# EAGLE design ESP8266_MQTT_light (EAGLE 9.4.2)
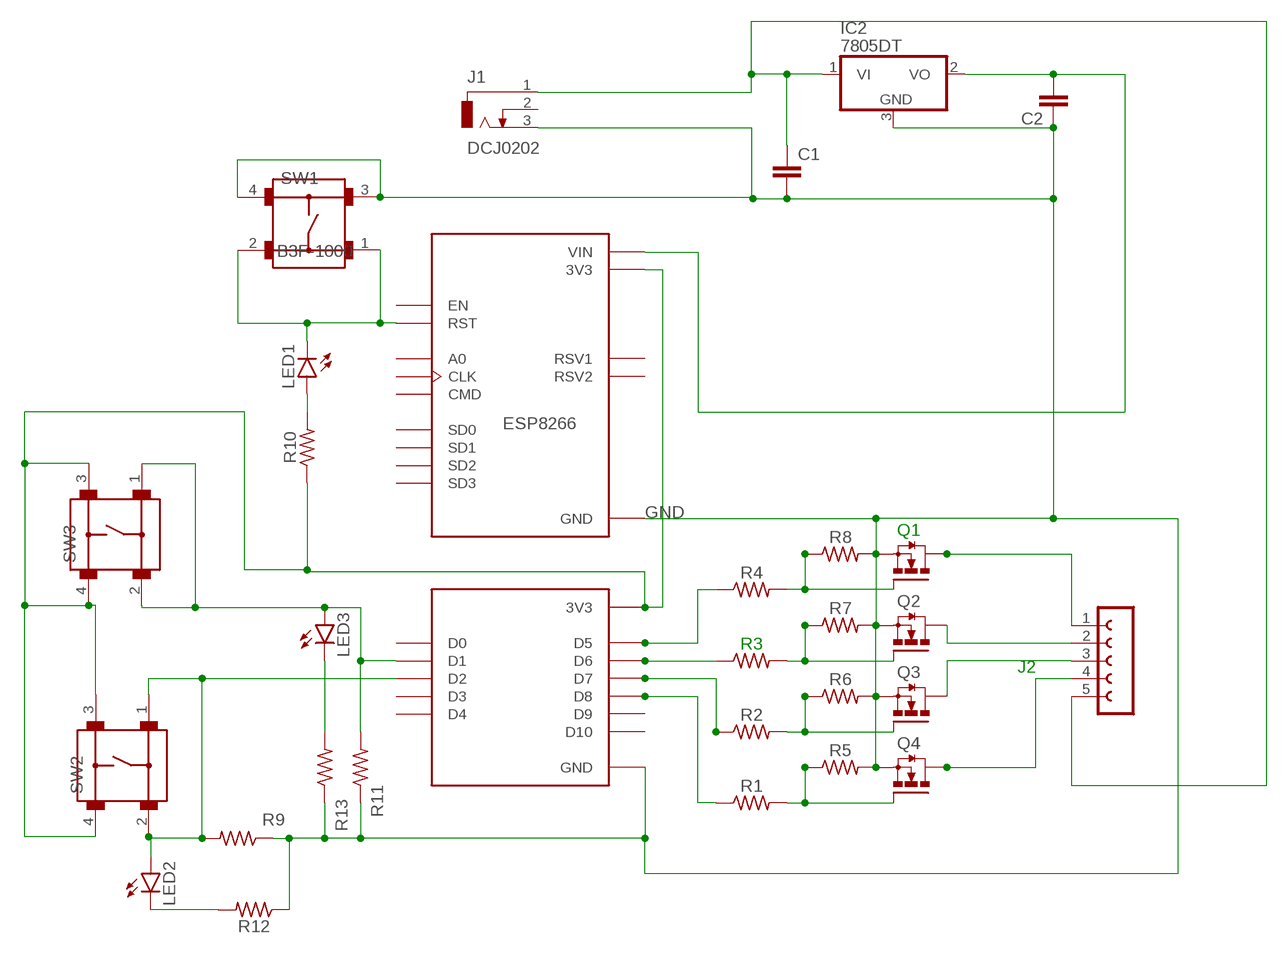
[diagram p0: schematic, sheet 1]

## Parts
C1  CC1005  [C1005]
C2  CC1005  [C1005]
ESP8266  113990105  [SEEED_113990105]
IC2  7805DT  [TO252]
J1  DCJ0202  [DCJ0202]
J2  RGBW1  FE05W  [FE05W]
LED1  LEDCHIPLED_1206  [CHIPLED_1206]
LED2  LEDCHIPLED_1206  [CHIPLED_1206]
LED3  LEDCHIPLED_1206  [CHIPLED_1206]
Q1  IRF3704S  [D2PACK]
Q2  IRF3704S  [D2PACK]
Q3  IRF3704S  [D2PACK]
Q4  IRF3704S  [D2PACK]
R1  1k  R-US_R1206  [R1206]
R2  1k  R-US_R1206  [R1206]
R3  1k  R-US_R1206  [R1206]
R4  1k  R-US_R1206  [R1206]
R5  10k  R-US_R1206  [R1206]
R6  10k  R-US_R1206  [R1206]
R7  10k  R-US_R1206  [R1206]
R8  10k  R-US_R1206  [R1206]
R9  10k  R-US_R1206  [R1206]
R10  33  R-US_R1206  [R1206]
R11  10k  R-US_R1206  [R1206]
R12  33  R-US_R1206  [R1206]
R13  33  R-US_R1206  [R1206]
SW1  B3F-1000  [B3F-1000]
SW2  B3F-1000  [B3F-1000]
SW3  B3F-1000  [B3F-1000]

## Nets
3.3VDC: ESP8266.J1_11(3V3) ESP8266.J2_6(3V3) ESP8266.J2_15(3V3) R10.1 SW2.3 SW2.4 SW3.3 SW3.4
5VDC: C2.2 ESP8266.J1_15(VIN) IC2.2(VO)
12VDC: C1.1 IC2.1(VI) J1.1 J2.5
B-IN: Q2.1(G) R3.2 R7.1
B-MAIN: ESP8266.J2_9(D6) R3.1
B-OUT: J2.2 Q2.2(D)
G-IN: Q3.1(G) R2.2 R6.1
G-MAIN: ESP8266.J2_10(D7) R2.1
G-OUT: J2.3 Q3.2(D)
GND: C1.2 C2.1 ESP8266.J1_10(GND) ESP8266.J1_14(GND) ESP8266.J2_7(GND) ESP8266.J2_14(GND) IC2.3(GND) J1.3 Q1.3(S) Q2.3(S) Q3.3(S) Q4.3(S) R5.2 R6.2 R7.2 R8.2 R9.1 R11.1 R12.1 R13.1 SW1.3 SW1.4
N$1: LED1.A R10.2
N$2: LED2.C R12.2
N$3: LED3.C R13.2
N$5: ESP8266.J2_3(D2) LED2.A R9.2 SW2.1 SW2.2
R-IN: Q4.1(G) R1.2 R5.1
R-MAIN: ESP8266.J2_11(D8) R1.1
R-OUT: J2.4 Q4.2(D)
RESET: ESP8266.J1_13(RST) LED1.C SW1.1 SW1.2
W-CTL: ESP8266.J2_2(D1) LED3.A R11.2 SW3.1 SW3.2
W-IN: Q1.1(G) R4.2 R8.1
W-MAIN: ESP8266.J2_8(D5) R4.1
W-OUT: J2.1 Q1.2(D)
Unconnected: ESP8266.J1_1(A0) ESP8266.J1_2(RSV1) ESP8266.J1_3(RSV2) ESP8266.J1_4(SD3) ESP8266.J1_5(SD2) ESP8266.J1_6(SD1) ESP8266.J1_7(CMD) ESP8266.J1_8(SD0) ESP8266.J1_9(CLK) ESP8266.J1_12(EN) ESP8266.J2_1(D0) ESP8266.J2_4(D3) ESP8266.J2_5(D4) ESP8266.J2_12(D9) ESP8266.J2_13(D10) J1.2

## Library data of the parts
C1 C2 = eagle-ltspice:C: CAPACITOR, European symbol; SPICEMODEL: NONE; SPICEPREFIX: C
ESP8266 = 113990105:113990105: NodeMCU v2 - Lua based ESP8266 development kit; AVAILABILITY: Unavailable; DESCRIPTION: An open-source firmware and development kit that helps you to Prototype your IOT product within a few Lua script lines; MF: Seeed Technology; MP: NodeMCU v2; PACKAGE: None; PRICE: None
IC2 = linear:78*: Positive VOLTAGE REGULATOR Source: http://cache.national.com/ds/LM/LM78L05.pdf http://www.fairchildsemi.com/ds/LM/LM7805.pdf
J1 = con-jack:DCJ0202: DC POWER JACK Source: DCJ0202.pdf; OC_FARNELL: unknown; OC_NEWARK: unknown
J2 = con-lsta:FE05W: FEMALE HEADER; OC_FARNELL: unknown; OC_NEWARK: unknown
LED1-LED3 = led:LED: LED OSRAM: - CHIPLED LG R971, LG N971, LY N971, LG Q971, LY Q971, LO R971, LY R971 LH N974, LH R974 LS Q976, LO Q976, LY Q976 LO Q996 - Hyper CHIPLED LW Q18S LB Q993, LB Q99A, LB R99A - SideLED LS A670, LO A670, LY A670, LG A670, LP A670 LB A673, LV A673, LT A673, LW A673 LH A674 LY A675 LS A676, LA A676, LO A676, LY A676, LW A676 LS A679, LY A679, LG A679 - Hyper Micro SIDELED® LS Y876, LA Y876, LO Y876, LY Y876 LT Y87S - SmartLED LW L88C, LW L88S LB L89C, LB L89S, LG L890 LS L89K, LO L89K, LY L89K LS L896, LA L896, LO L896, LY L896 - TOPLED LS T670, LO T670, LY T670, LG T670, LP T670 LSG T670, LSP T670, LSY T670, LOP T670, LYG T670 LG T671, LOG T671, LSG T671 LB T673, LV T673, LT T673, LW T673 LH T674 LS T676, LA T676, LO T676, LY T676, LB T676, LH T676, LSB T676, LW T676 LB T67C, LV T67C, LT T67C, LS T67K, LO T67K, LY T67K, LW E67C LS E67B, LA E67B, LO E67B, LY E67B, LB E67C, LV E67C, LT E67C LW T67C LS T679, LY T679, LG T679 LS T770, LO T770, LY T770, LG T770, LP T770 LB T773, LV T773, LT T773, LW T773 LH T774 LS E675, LA E675, LY E675, LS T675 LS T776, LA T776, LO T776, LY T776, LB T776 LHGB T686 LT T68C, LB T68C - Hyper Mini TOPLED® LB M676 - Mini TOPLED Santana® LG M470 LS M47K, LO M47K, LY M47K Source: http://www.osram.convergy.de LUXEON: - LUMILED® LXK2-PW12-R00, LXK2-PW12-S00, LXK2-PW14-U00, LXK2-PW14-V00 LXK2-PM12-R00, LXK2-PM12-S00, LXK2-PM14-U00 LXK2-PE12-Q00, LXK2-PE12-R00, LXK2-PE12-S00, LXK2-PE14-T00, LXK2-PE14-U00 LXK2-PB12-K00, LXK2-PB12-L00, LXK2-PB12-M00, LXK2-PB14-N00, LXK2-PB14-P00, LXK2-PB14-Q00 LXK2-PR12-L00, LXK2-PR12-M00, LXK2-PR14-Q00, LXK2-PR14-R00 LXK2-PD12-Q00, LXK2-PD12-R00, LXK2-PD12-S00 LXK2-PH12-R00, LXK2-PH12-S00 LXK2-PL12-P00, LXK2-PL12-Q00, LXK2-PL12-R00 Source: www.luxeon.com KINGBRIGHT: KA-3528ASYC Source: www.kingbright.com
Q1-Q4 = transistor-power:IRF3704: SMPS MOSFET HEXFET® Power MOSFET Source: http://www.irf.com/product-info/datasheets/data/irf3704.pdf
R1-R13 = rcl:R-US_: RESISTOR, American symbol; SPICEPREFIX: R
SW1-SW3 = Switch:B3F-1000: Tactile Switch SPST-NO Top Actuated Through Hole Manufacturer's datasheet <https://omronfs.omron.com/en_US/ecb/products/pdf/en-b3f.pdf>; CREATED_BY: PCBLayout.com; DIGI_KEY_PART_NUMBER: SW400-ND; MANUFACTURER: Omron Electronics Inc-EMC Div; MPN: B3F-1000; PACKAGE: SPST-NO

## Board
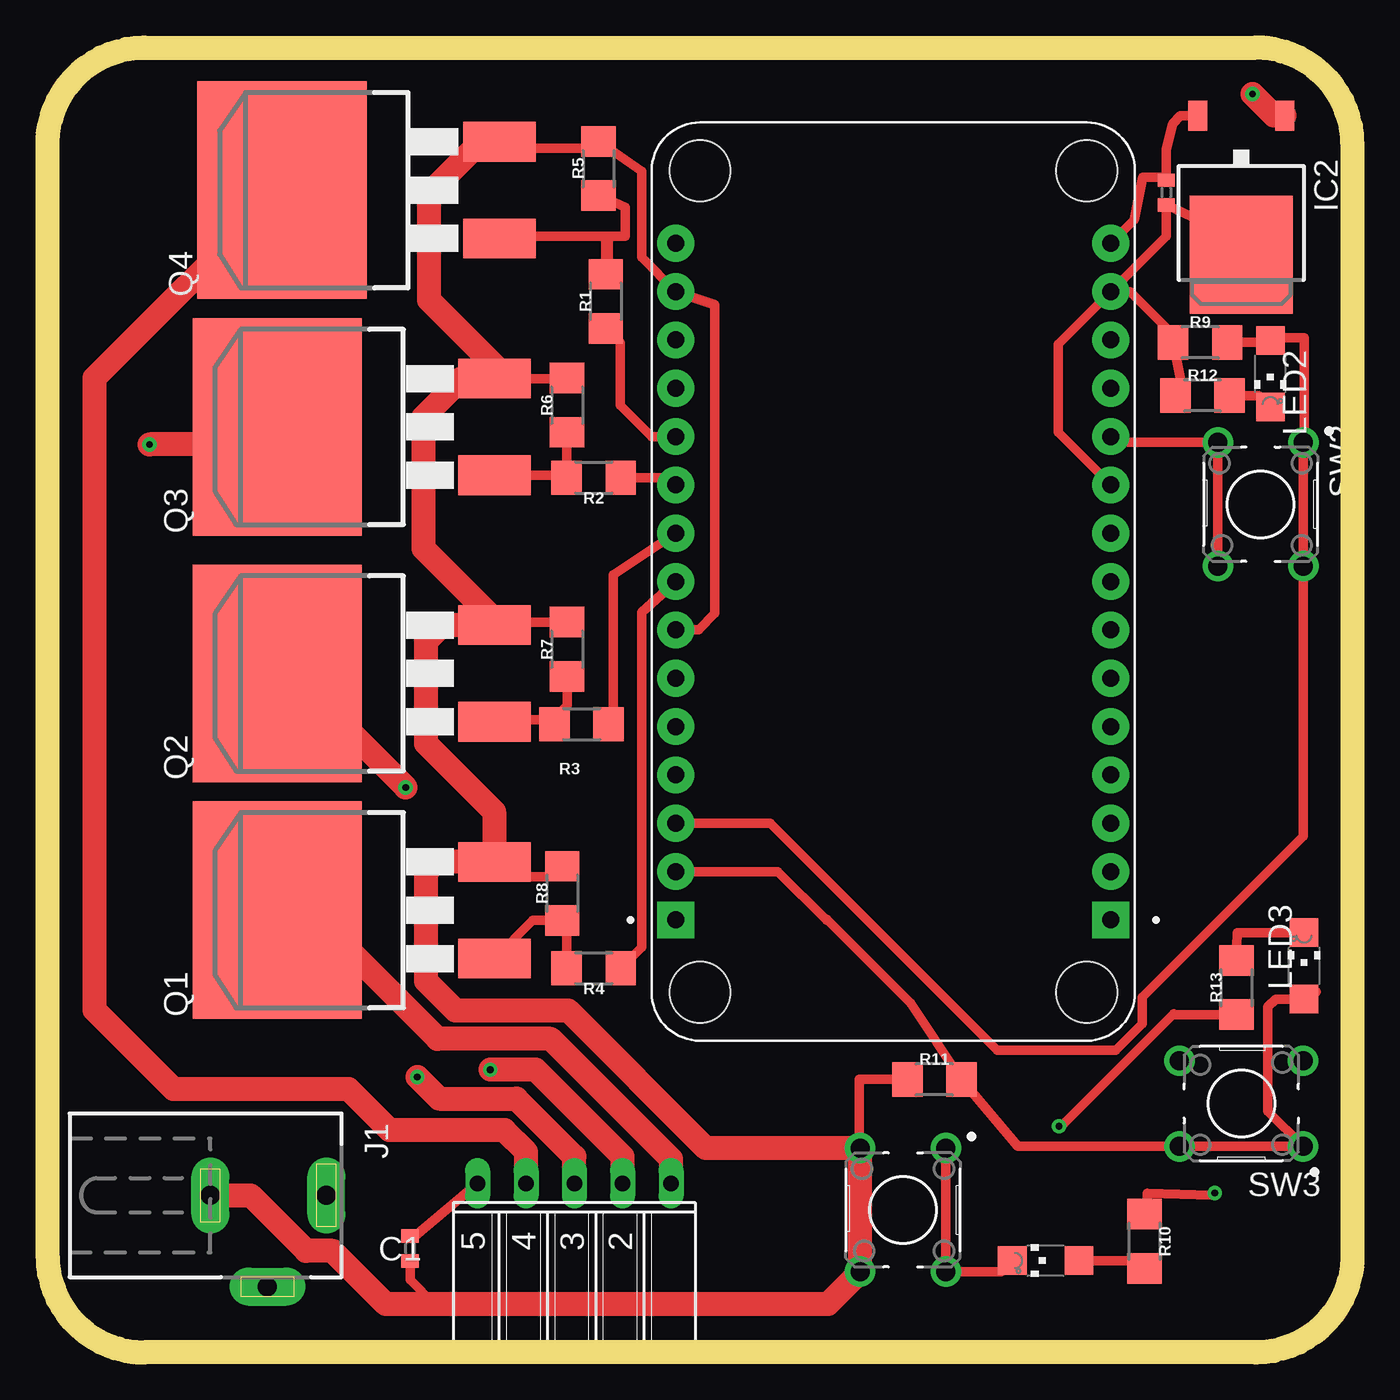
[diagram p1: board, top side]
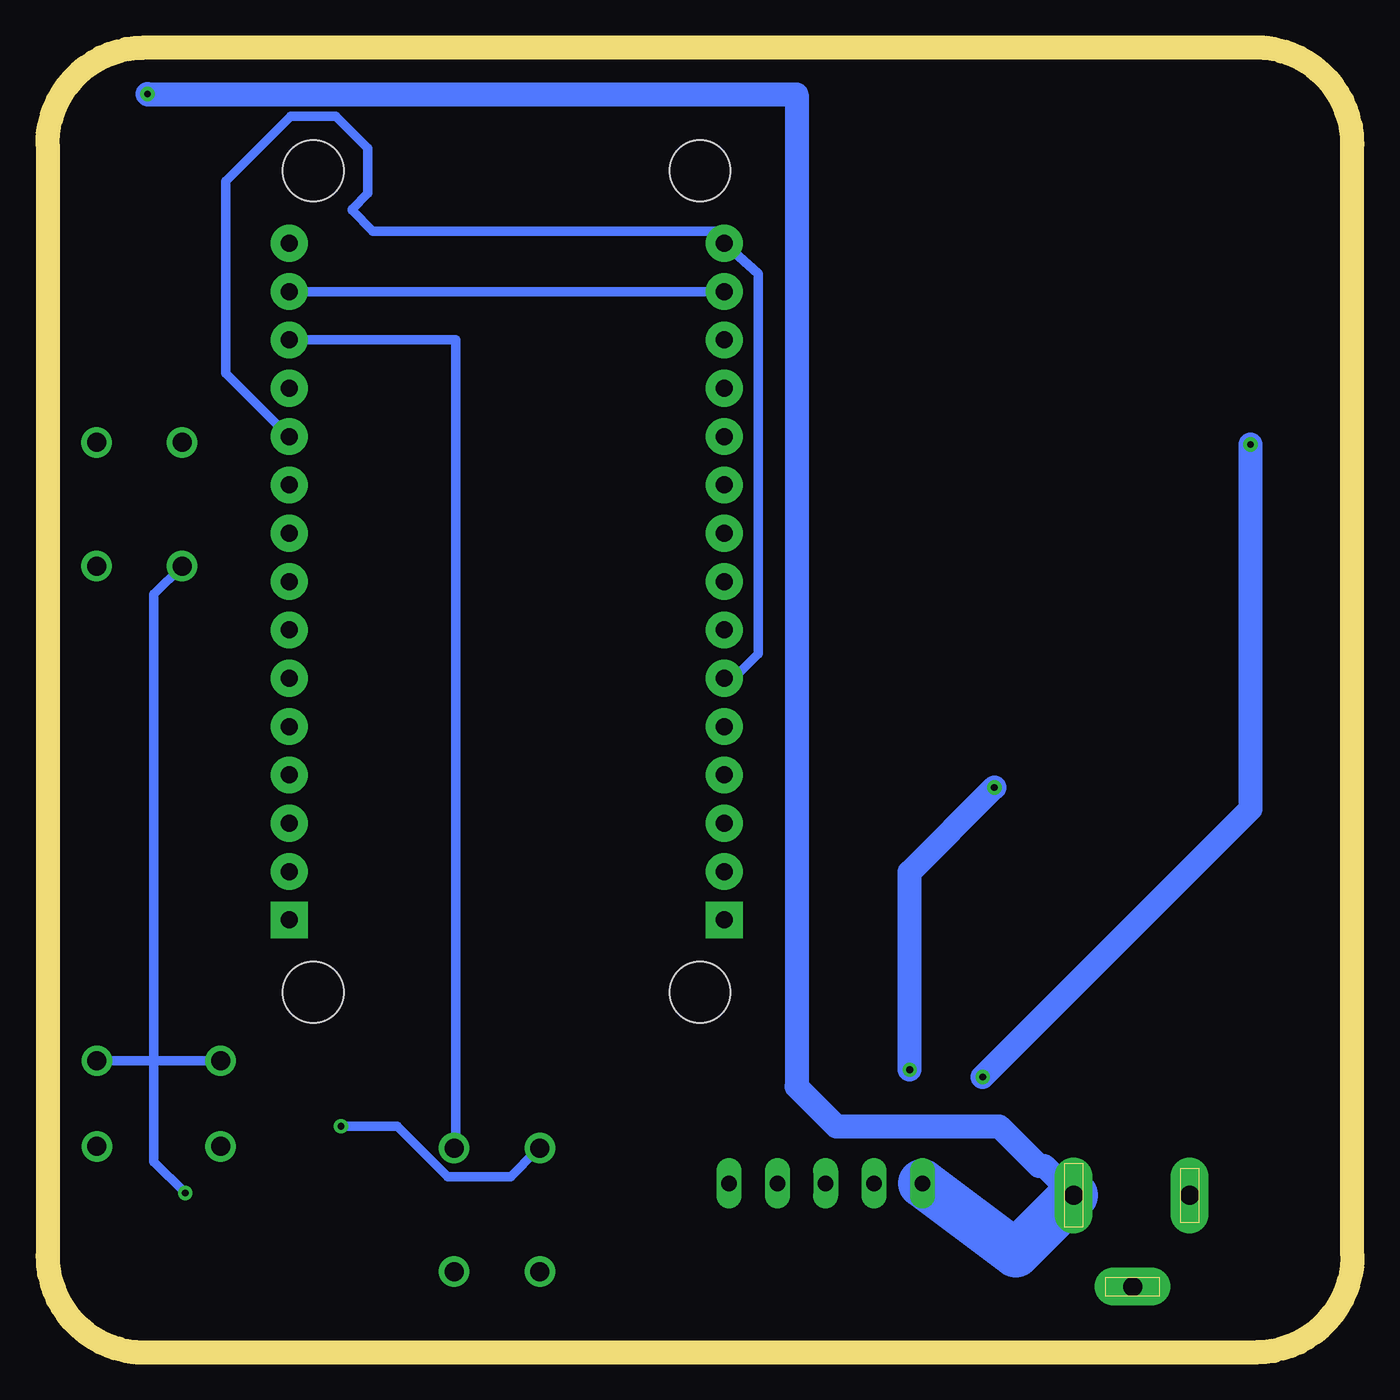
[diagram p2: board, bottom side, seen from below]

Size 68.58 x 68.58 mm. Coordinates in mm from the lower left corner, seen from the top.
Outline: 68.58,5.08 68.58,63.5 arc90 63.5,68.58 5.08,68.58 arc90 0,63.5 0,5.08 arc90 5.08,0 63.5,0
Outline: 68.58,5.08 arc-90 63.5,0
Outline: 68.58,5.08 arc-90 63.5,0
Copper layers (1*16): Top 0.035mm / dielectric 1.5mm / Bottom 0.035mm
Design rules "default *": minimum track width 20mil, minimum drill 0.35mm, track to track 6mil, track to pad 6mil, pad to pad 6mil, via to via 6mil, smd to smd 6mil, copper to edge 40mil, drill to drill 6mil, minimum pad ring 10mil, minimum via ring 8mil, stop-mask expansion 4mil, vias tented up to drill 0mil, thermal gap 10mil

### Footprints (pad centres in the part's own frame; a part is rotated, then mirrored left to right if it is on the bottom)
C1005 = smd 0.7 x 0.9: 1 -0.65,0; 2 0.65,0
SEEED_113990105 = drill 0.889 pad 1.93 square: J1_1 -11.43,17.78; J2_1 11.43,17.78 | drill 0.889 pad 1.93: J1_2 -11.43,15.24; J1_3 -11.43,12.7; J1_4 -11.43,10.16; J1_5 -11.43,7.62; J1_6 -11.43,5.08; J1_7 -11.43,2.54; J1_8 -11.43,0; J1_9 -11.43,-2.54; J1_10 -11.43,-5.08; J1_11 -11.43,-7.62; J1_12 -11.43,-10.16; J1_13 -11.43,-12.7; J1_14 -11.43,-15.24; J1_15 -11.43,-17.78; J2_2 11.43,15.24; J2_3 11.43,12.7; J2_4 11.43,10.16; J2_5 11.43,7.62; J2_6 11.43,5.08; J2_7 11.43,2.54; J2_8 11.43,0; J2_9 11.43,-2.54; J2_10 11.43,-5.08; J2_11 11.43,-7.62; J2_12 11.43,-10.16; J2_13 11.43,-12.7; J2_14 11.43,-15.24; J2_15 11.43,-17.78 | hole 3.2: -10.16,21.59; 10.16,21.59; 10.16,-21.59; -10.16,-21.59
TO252 = smd 1 x 1.6: 1 -2.28,-4.8; 2 2.28,-4.8 | smd 5.4 x 6.2: 3 0,2.5
DCJ0202 = drill 1 pad 2 long: 1 0,3.1; 2 4.8,0; 3 0,-3
FE05W = drill 0.813 long: 1 -5.08,0; 2 -2.54,0; 3 0,0; 4 2.54,0; 5 5.08,0
CHIPLED_1206 = smd 1.5 x 1.5: A 0,-1.75; C 0,1.75
D2PACK = smd 2.083 x 3.81: 1 -2.54,-8.89; 3 2.54,-8.89 | smd 11.43 x 8.89: 2 0,2.54
R1206 = smd 1.6 x 1.803: 1 -1.422,0; 2 1.422,0
B3F-1000 = drill 1 pad 1.6: 1 -3.25,2.25; 2 3.25,2.25; 3 -3.25,-2.25; 4 3.25,-2.25

### Placement (x,y rotation side)
C1  19.05,5.46 270 top
C2  58.8,60.96 90 top
ESP8266  44.45,40.51 180 top
IC2  62.74,60.2 180 top
J1  11.56,8.26 270 top
J2  27.69,8.89 180 top
LED1  52.45,4.83 90 top
LED2  64.26,51.44 180 top
LED3  66.04,20.32 0 top
Q1  14.61,23.24 90 top
Q2  14.61,35.69 90 top
Q3  14.61,48.64 90 top
Q4  14.86,61.09 90 top
R1  29.34,55.24 90 top
R2  28.7,45.97 180 top
R3  28.07,33.02 180 top
R4  28.7,20.19 180 top
R5  28.96,62.23 90 top
R6  27.3,49.78 90 top
R7  27.3,36.96 90 top
R8  27.05,24.13 90 top
R9  60.58,53.09 0 top
R10  57.66,5.84 270 top
R11  46.61,14.35 0 top
R12  60.71,50.29 0 top
R13  62.48,19.18 90 top
SW1  44.96,7.49 270 top
SW2  63.75,44.58 270 top
SW3  62.74,13.08 180 top

### Tracks (layer width: path | path; a pad name or v marks a point on that pad's centre or on a via)
3.3VDC  (via drill 0.35)
  Top 0.508: v61.34,8.38 61.21,8.25 57.78,8.37 57.78,6.82 R10.1 | SW2.4 SW2.3 56.19,47.83 ESP8266.J1_11
  Bottom 0.508: ESP8266.J2_6 32.51,35.43 31.22,36.73 31.22,56.69 ESP8266.J2_15 33.53,58.93 51.49,58.93 52.58,60.02 52.58,60.08 51.74,60.91 51.74,63.29 53.42,64.97 55.8,64.97 59.21,61.56 59.21,51.46 ESP8266.J1_11 | v61.34,8.38 62.99,10.03 62.99,15.33 | 62.99,15.33 62.99,39.84 SW2.4 | SW3.4 62.99,15.33 | SW3.3 62.99,15.33
5VDC
  Top 0.508: ESP8266.J1_15 57.12,59.53 57.56,61.76 58.65,61.76 C2.2 58.8,63.24 59.13,64.59 59.54,65 IC2.2
12VDC  (via drill 0.35)
  Top 0.508: IC2.1 | C1.1 19.31,6.11 J2.5
  Top 1.27: IC2.1 64.47,65 v63.32,66.14
  Bottom 1.27: J1.1 16.21,9.8 16.48,9.8 18.57,11.89 27.13,11.89 29.21,13.97 29.21,66.12 63.3,66.12 v63.32,66.14
  Bottom 2.54: J2.5 17.7,5.21 J1.1
B-IN
  Top 0.508: 27.43,35.99 R7.1 27.3,34.01 26.54,33.25 | 26.54,33.25 23.8,33.25 Q2.1 | 26.54,33.25 26.92,33.25 R3.2
B-MAIN
  Top 0.508: R3.1 29.74,33.25 29.74,40.87 ESP8266.J2_9
B-OUT  (via drill 0.35)
  Top 0.508: 8.1,32.38 Q2.2
  Top 1.27: Q2.2 12.83,35.69 v18.82,29.69 | J2.2 30.23,10.29 25.65,14.86 v23.27,14.86
  Bottom 1.27: v23.27,14.86 23.27,25.25 v18.82,29.69
G-IN
  Top 0.508: 27.43,48.69 R6.1 27.28,48.34 R2.2 27.15,46.1 Q3.1 23.8,46.13 23.95,46.28
G-MAIN
  Top 0.508: 29.57,46.08 R2.1 32.64,45.97 ESP8266.J2_10
G-OUT  (via drill 0.35)
  Top 0.508: 11.91,48.44 Q3.2
  Top 1.27: Q3.2 11.15,47.73 v5.36,47.73 | J2.3 27.69,10.29 24.64,13.34 20.57,13.34 v19.43,14.48
  Bottom 1.27: v19.43,14.48 5.36,28.55 v5.36,47.73
GND  (via drill 0.35)
  Top 0.508: ESP8266.J1_14 58.8,58.67 C2.1 61.58,59 62.43,59 63.12,58.31 IC2.3 62.95,57.89 63.42,57.68 | ESP8266.J1_14 53.11,52.98 53.11,48.36 ESP8266.J1_10 | R6.2 27.3,51.18 Q3.3 23.47,51.41 23.47,51.89 | R8.2 26.85,24.99 24.46,24.99 23.8,25.65 Q1.3 23.47,25.98 | Q2.3 23.47,38.53 23.62,38.38 R7.2 | ESP8266.J2_7 34.21,37.97 35.08,38.84 35.08,55.07 ESP8266.J2_14 31.22,57.56 31.22,62.07 R5.2 28.88,63.3 24.13,63.3 23.8,63.63 Q4.3 22.76,63.63 | C1.2 19.05,3.81 20.32,2.54 | ESP8266.J1_14 56.9,55.75 59.56,53.09 R9.1 59.68,50.41 R12.1 | R11.1 42.67,14.35 42.67,10.78 SW1.3 | v53.16,11.89 53.29,11.89 59.19,17.79 59.27,17.75 R13.1
  Top 1.27: 23.47,25.98 23.47,28.42 19.89,32 19.89,37.36 20.75,38.23 Q2.3 | Q3.3 21.77,51.18 19.76,49.17 19.76,42.24 23.47,38.53 | 23.47,51.89 20.04,55.32 20.04,60.91 22.76,63.63 | Q1.3 20.42,25.78 19.89,25.25 19.89,19.53 21.44,17.98 27.36,17.98 34.6,10.74 SW1.3 SW1.4 41.01,2.54 20.32,2.54 17.78,2.54 14.99,5.33 13.59,5.33 10.67,8.26 J1.3
  Bottom 0.508: 55.82,55.81 ESP8266.J1_14 ESP8266.J2_14 | v53.16,11.89 50.19,11.89 47.55,9.25 44.25,9.25 42.93,10.57 SW1.3
N$1
  Top 0.508: R10.2 57.49,4.83 LED1.A
N$2
  Top 0.508: R12.2 63.66,50.29 LED2.C
N$3
  Top 0.508: LED3.C 62.52,22.07 R13.2
N$5
  Top 0.508: 61.52,53.19 R9.2 64.16,53.09 LED2.A 64.42,53.34 66.04,53.34 66.04,47.86 SW2.1 SW2.2 66,27.14 57.53,18.67 57.53,17.27 56.13,15.88 49.91,15.88 37.97,27.81 ESP8266.J2_3
R-IN
  Top 0.508: 29.46,58.67 29.46,56.8 | R5.1 30.35,60.2 30.35,58.67 29.46,58.67 | 29.46,58.67 23.8,58.67 Q4.1 | R1.2 29.34,58.55 29.46,58.67
R-MAIN
  Top 0.508: R1.1 30.1,53.06 30.1,49.78 31.75,48.13 ESP8266.J2_11
R-OUT
  Top 0.508: 12.24,60.98 Q4.2
  Top 1.27: 12.24,60.98 2.46,51.21 2.46,18.01 6.63,13.84 15.82,13.84 17.98,11.68 24,11.68 25.15,10.54 J2.4
RESET
  Top 0.508: LED1.C 50.12,4.24 SW1.2 SW1.1
  Bottom 0.508: ESP8266.J1_13 47.12,53.21 47.12,10.83 SW1.1
W-CTL
  Top 0.508: 33.12,25.07 ESP8266.J2_2 38.38,25.27 40.94,22.71 40.94,22.78 45.37,18.34 R11.2 50.98,10.83 SW3.2 SW3.1 64.14,12.68 64.14,18.16 64.54,18.57 LED3.A 66.67,18.97
W-IN
  Top 0.508: 24.46,21.36 23.8,20.7 Q1.1 25.5,22.71 R8.1 27.28,22.48 R4.2
W-MAIN
  Top 0.508: ESP8266.J2_8 31.22,38.89 31.22,21.29 R4.1
W-OUT
  Top 0.508: Q1.2 13.74,23.24
  Top 1.27: 13.74,23.24 20.5,16.48 26.44,16.48 32.77,10.16 J2.1